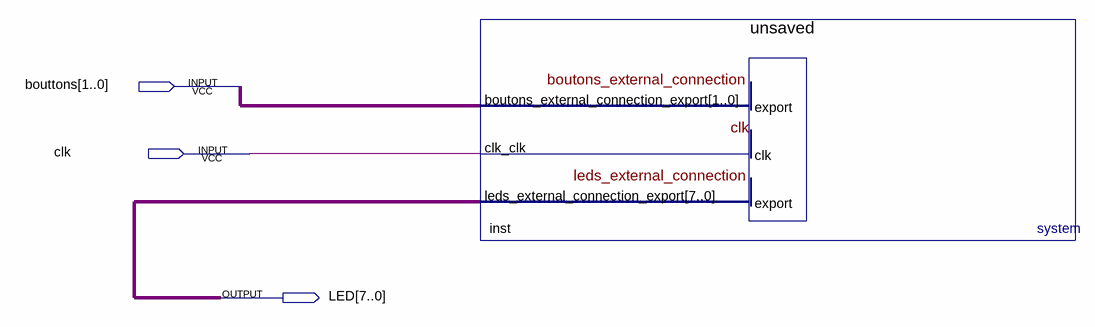
[diagram p0: schematic sheet]
// Quartus schematic sopc_compteur.bdf as structural Verilog: 1 symbols, 3 pins
module sopc_compteur (
  input  [1:0] bouttons,
  input  clk,
  output [7:0] LED
);

  unsaved inst (.boutons_external_connection_export(bouttons), .clk_clk(clk), .leds_external_connection_export(LED));
endmodule
